# Altium schematic sheet IQ_Modulator.SchDoc: =ProjectName
size 420 x 297 mm; Author: SBH; CompanyName: WUT; DrawnBy: SBH; Organization: ISE-WUT; Address1: Warsaw Univeristy of Technology; Address2: Nowowiejska 15/19; Revision: -; SheetNumber: -; SheetTotal: -; EDA_Number: ARTIQ; Projet: ADC/DAC MEZZANINE; ModifiedBy: -; CreateDate: XX/XX/XXXX; CheckedDate: -; Title2: IQ_Modulator.SchDoc; DivGrp: ISE; Designer: SBH; ModifiedDate: -; ProjectName: ADC/DAC MEZZANINE
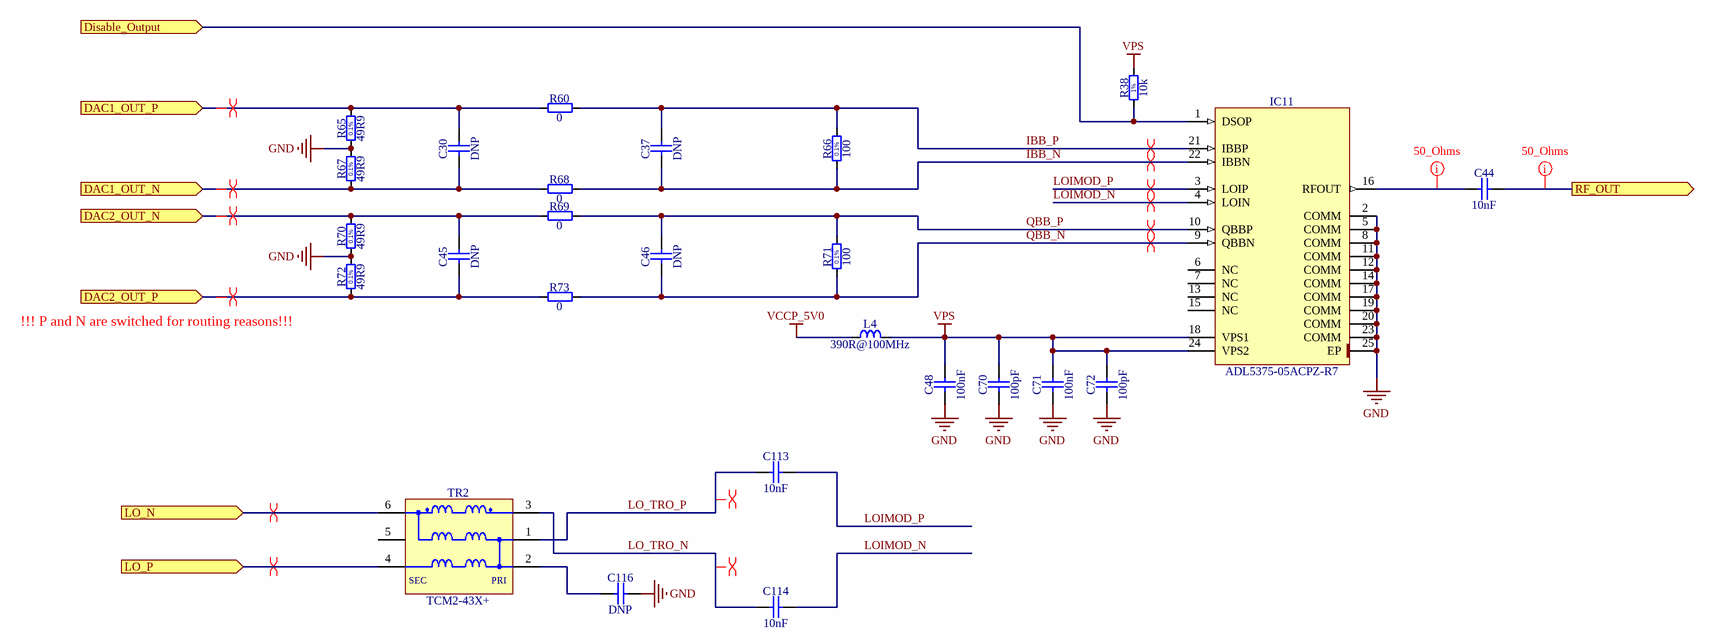
[diagram p0: IQ_Modulator.SchDoc]

## Parts
C30  DNP  [CAPC1005X55N]
C37  DNP  [CAPC1005X55N]
C44  10nF  [CAPC1005X55N]
C45  DNP  [CAPC1005X55N]
C46  DNP  [CAPC1005X55N]
C48  100nF  [CAPC1005X55N]
C70  100pF  [CAPC1005X55N]
C71  100nF  [CAPC1005X55N]
C72  100pF  [CAPC1005X55N]
C113  10nF  [CAPC1005X55N]
C114  10nF  [CAPC1005X55N]
C116  DNP  [CAPC1005X55N]
IC11  ADL5375-05ACPZ-R7  [QFN50P400X400X100-25N-S265]
L4  390R@100MHz  [INDC1608X95N]
R38  10k  [RESC1005X40N]
R60  0  [RESC1005X40N]
R65  49R9  [RESC1005X35N]
R66  100  [RESC1005X35N]
R67  49R9  [RESC1005X35N]
R68  0  [RESC1005X40N]
R69  0  [RESC1005X40N]
R70  49R9  [RESC1005X35N]
R71  100  [RESC1005X35N]
R72  49R9  [RESC1005X35N]
R73  0  [RESC1005X40N]
TR2  TCM2-43X+  [XFMR_MINI-CIRCUITS_DB1627]

## Ports
DAC1_OUT_N (in), DAC1_OUT_P (in), DAC2_OUT_N (in), DAC2_OUT_P (in), Disable_Output (in), LO_N (in), LO_P (in), RF_OUT (out)

## Nets
GND: C48.1 C70.1 C71.1 C72.1 C116.2 IC11.2(COMM) IC11.5(COMM) IC11.8(COMM) IC11.11(COMM) IC11.12(COMM) IC11.14(COMM) IC11.17(COMM) IC11.19(COMM) IC11.20(COMM) IC11.23(COMM) IC11.25(EP) R65.1 R67.2 R70.1 R72.2
VCCP_5V0: L4.1
VPS: C48.2 C70.2 C71.2 C72.2 IC11.18(VPS1) IC11.24(VPS2) L4.2 R38.2
DAC1_OUT_N: C30.1 R67.1 R68.1 ; port DAC1_OUT_N
DAC1_OUT_P: C30.2 R60.1 R65.2 ; port DAC1_OUT_P
DAC2_OUT_N: C45.2 R69.1 R70.2 ; port DAC2_OUT_N
DAC2_OUT_P: C45.1 R72.1 R73.1 ; port DAC2_OUT_P
Disable_Output: IC11.1(DSOP) R38.1 ; port Disable_Output
IBB_N: C37.1 IC11.22(IBBN) R66.1 R68.2
IBB_P: C37.2 IC11.21(IBBP) R60.2 R66.2
LO_N: TR2.6(S1) ; port LO_N
LO_P: TR2.4(S1) ; port LO_P
LO_TRO_N: C114.1 TR2.3(P1)
LO_TRO_P: C113.1 TR2.1(P1)
LOIMOD_N: C114.2 IC11.4(LOIN)
LOIMOD_P: C113.2 IC11.3(LOIP)
QBB_N: C46.1 IC11.9(QBBN) R71.1 R73.2
QBB_P: C46.2 IC11.10(QBBP) R69.2 R71.2
RF_OUT: C44.2 ; port RF_OUT
NetC44_1: C44.1 IC11.16(RFOUT)
NetC116_1: C116.1 TR2.2(P1)

Not connected (* = marked no-connect by the designer): IC11 6(NC) 7(NC) 13(NC) 15(NC); TR2 5(NC)

## Layout directives
net class 50_Ohms: NetC44_1, RF_OUT
differential pair: DAC1_OUT_N, DAC1_OUT_P, DAC2_OUT_N, DAC2_OUT_P, IBB_N, IBB_P, LO_N, LO_P, LO_TRO_N, LO_TRO_P, LOIMOD_N, LOIMOD_P, QBB_N, QBB_P

## Notes on the sheet
- (near R72) !!! P and N are switched for routing reasons!!!
- Project/Equipment
- Document
- Designer
- Drawn by
- Check.by
- File
- Last Mod.
- Print Date
- Sheet
- Size
- A3
- of
- Rev
- (in symbol R0402_10K_1%_0.0625W_100PPM) 1%
- (in symbol R0402_49R9_0.1%_0.063W_25PPM) 0.1%
- (in symbol R0402_100R_0.1%_0.063W_25PPM) 0.1%
- (in symbol XFMR_MINI-CIRCUITS_TCM2-43X+) SEC; PRI

## Library data of the parts
C30 C37 C45 C46 = CC0402_1.5NF_50V_10%_X7R: Non-polarised capacitor; Part Description: SMD Multilayer Chip Ceramic Capacitor; Manufacturer: GENERIC; Manufacturer1 Part Number: 223858715625; Value: 1.5nF; Voltage: 50V; TC: X7R; Tolerance: ±10%; Mounted: DNP; Part Number: CC0402_1.5NF_50V_10%_X7R; Component Kind: Standard; Component Type: Standard; Pin Count: 2; Status: Not Recommended; Manufacturer Part Number: CC0402_1.5NF_50V_10%_X7R; Case: 0402; Socket: No; SMD: Yes; Sense: No; Manufacturer1 Example: PHYCOMP; Manufacturer1 ComponentHeight: 0.55mm; HelpURL: \\cern.ch\dfs\Applications\Altium\Datasheets\CC0402_X7R_PHYCOMP.pdf; Author: CERN DEM JLC; CreateDate: 2007-12-03; LatestRevisionDate: 2007-12-03
C44 C113 C114 = CC0402_10NF_16V_10%_X7R: Non-polarised capacitor; Part Description: SMD Multilayer Chip Ceramic Capacitor; Manufacturer: GENERIC; Manufacturer1 Part Number: 223878715636; Voltage: 16V; TC: X7R; Tolerance: ±10%; Part Number: CC0402_10NF_16V_10%_X7R; Component Kind: Standard; Component Type: Standard; Pin Count: 2; Value: 10nF; Status: Not Recommended; Manufacturer Part Number: CC0402_10NF_16V_10%_X7R; Case: 0402; Mounted: Yes; Socket: No; SMD: Yes; Sense: No; Manufacturer1 Example: PHYCOMP; Manufacturer1 ComponentHeight: 0.55mm; HelpURL: \\cern.ch\dfs\Applications\Altium\Datasheets\CC0402_X7R_PHYCOMP.pdf; Author: CERN DEM JLC; CreateDate: 2007-12-03; LatestRevisionDate: 2007-12-03
C48 C71 = CC0402_100NF_16V_10%_X7R: Non-polarised capacitor; Part Description: SMD Multilayer Chip Ceramic Capacitor; Manufacturer: GENERIC; Manufacturer1 Part Number: GRM155R71C104KA88D; Voltage: 16V; TC: X7R; Tolerance: ±10%; Part Number: CC0402_100NF_16V_10%_X7R; Component Kind: Standard; Component Type: Standard; Pin Count: 2; Value: 100nF; Status: Not Recommended; Manufacturer Part Number: CC0402_100NF_16V_10%_X7R; Case: 0402; Mounted: Yes; Socket: No; SMD: Yes; Sense: No; Manufacturer1 Example: MURATA; Manufacturer1 ComponentHeight: 0.55mm; HelpURL: \\cern.ch\dfs\Applications\Altium\Datasheets\CC0402_X7R_MURATA_GRM.pdf; Author: CERN DEM JLC; CreateDate: 2013-12-05; LatestRevisionDate: 2007-12-03
C70 C72 = CC0402_100PF_50V_5%_C0G: Non-polarised capacitor; Part Description: SMD Multilayer Chip Ceramic Capacitor; Manufacturer: GENERIC; Manufacturer1 Part Number: C0402C101J5GACTU; Voltage: 50V; TC: C0G/NP0; Tolerance: ±5%; Part Number: CC0402_100PF_50V_5%_C0G; Component Kind: Standard; Component Type: Standard; Pin Count: 2; Value: 100pF; Status: Preferred; Manufacturer Part Number: CC0402_100PF_50V_5%_C0G; Case: 0402; Mounted: Yes; Socket: No; SMD: Yes; Sense: No; Manufacturer1 Example: KEMET; Manufacturer1 ComponentHeight: 0.55mm; HelpURL: \\cern.ch\dfs\Applications\Altium\Datasheets\CC0805_C0G_KEMET_(Commercial Grade).pdf; Author: CERN DEM JLC; CreateDate: 2007-12-03; LatestRevisionDate: 2015-04-22
C116 = CC0402_100PF_50V_5%_C0G: Non-polarised capacitor; Part Description: SMD Multilayer Chip Ceramic Capacitor; Manufacturer: GENERIC; Manufacturer1 Part Number: C0402C101J5GACTU; Value: 100pF; Voltage: 50V; TC: C0G/NP0; Tolerance: ±5%; Mounted: DNP; Part Number: CC0402_100PF_50V_5%_C0G; Component Kind: Standard; Component Type: Standard; Pin Count: 2; Status: Preferred; Manufacturer Part Number: CC0402_100PF_50V_5%_C0G; Case: 0402; Socket: No; SMD: Yes; Sense: No; Manufacturer1 Example: KEMET; Manufacturer1 ComponentHeight: 0.55mm; HelpURL: \\cern.ch\dfs\Applications\Altium\Datasheets\CC0805_C0G_KEMET_(Commercial Grade).pdf; Author: CERN DEM JLC; CreateDate: 2007-12-03; LatestRevisionDate: 2015-04-22
IC11 = ADL5375-05ACPZ-R7: 400 MHz to 6 GHz Broadband Quadrature Modulator; Manufacturer: ANALOG DEVICES; PressFit: No; Bonding: No; Part Number: ADL5375-05ACPZ-R7; Component Kind: Standard; Component Type: Standard; Device: ADL5375-05ACPZ-R7; PackageDescription: QFN,0.50mm pitch,square;6 pin X 6 pin,4.0mm X 4.0mm X 1.00mm H body (w/thermal tab 2.65 X 2.65mm),  IPC Medium Density; Part Description: 400 MHz to 6 GHz Broadband Quadrature Modulator; Manufacturer Part Number: ADL5375-05ACPZ-R7; Pin Count: 25; Case: QFN24; Mounted: Yes; Socket: No; SMD: Yes; Sense: No; ComponentHeight: 1mm; Author: CERN DEM JLC; HelpURL: \\cern.ch\dfs\Applications\Altium\Datasheets\ADL5375-05ACPZ-R7.pdf; CreateDate: 2010-08-24; LatestRevisionDate: 2010-08-24
L4 = IND0603_TDK_MPZ1608R391A: Inductor; Part Description: SMT Chip Bead for Power Line; Manufacturer: TDK; Power: 1.2A; Resistance: 0.12R; Tolerance: ±25%; Part Number: IND0603_TDK_MPZ1608R391A; Component Kind: Standard; Component Type: Standard; Pin Count: 2; Value: 390R@100MHz; Status: None; Manufacturer Part Number: MPZ1608R391A; Case: 0603; Mounted: Yes; Socket: No; SMD: Yes; Sense: No; ComponentHeight: 0.95mm; HelpURL: \\cern.ch\dfs\Applications\Altium\Datasheets\IND0603_TDK_MPZ1608.pdf; Author: CERN DEM JLC; CreateDate: 2009-12-02; LatestRevisionDate: 2009-12-02
R38 = R0402_10K_1%_0.0625W_100PPM: Resistor - 1%; Part Description: General Purpose Thick Film Chip Resistor; Manufacturer: GENERIC; Manufacturer1 Part Number: 232270671003L; TC: ±100ppm/°C; Part Number: R0402_10K_1%_0.0625W_100PPM; Component Kind: Standard; Component Type: Standard; Pin Count: 2; Value: 10k; Status: Not recommended; Power: 0.0625W; Tolerance: ±1%; Manufacturer Part Number: R0402_10K_1%_0.0625W_100PPM; Case: 0402; Mounted: Yes; Sense: No; Socket: No; SMD: Yes; Manufacturer1 Example: YAGEO PHYCOMP; Manufacturer1 ComponentHeight: 0.4mm; HelpURL: \\cern.ch\dfs\Applications\Altium\Datasheets\R0402_Phycomp_RC0402.pdf; Author: CERN DEM JLC; CreateDate: 2007-12-03; LatestRevisionDate: 2012-10-17
R60 R68 R69 R73 = R0402_0R_JUMPER: Resistor; Part Description: 1A (0.05R Max DC Resistance) Zero Ohm Jumper; Manufacturer: GENERIC; Manufacturer1 Part Number: 232270591001L; Part Number: R0402_0R_JUMPER; Component Kind: Standard; Component Type: Standard; Pin Count: 2; Value: 0; Status: Not recommended; Manufacturer Part Number: R0402_0R_JUMPER; Case: 0402; Mounted: Yes; Sense: No; Socket: No; SMD: Yes; Manufacturer1 Example: YAGEO PHYCOMP; Manufacturer1 ComponentHeight: 0.4mm; HelpURL: \\cern.ch\dfs\Applications\Altium\Datasheets\R0402_Phycomp_RC0402.pdf; Author: CERN DEM JLC; CreateDate: 2007-12-03; LatestRevisionDate: 2012-10-17
R65 R67 R70 R72 = R0402_49R9_0.1%_0.063W_25PPM: Resistor - 0.1%; Part Description: Thin Film Precision Resistor; Manufacturer: GENERIC; Manufacturer1 Part Number: CPF0402B49R9E1; Power: 0.063W; TC: ±25ppm/°C; Part Number: R0402_49R9_0.1%_0.063W_25PPM; Component Kind: Standard; Component Type: Standard; Pin Count: 2; Value: 49R9; Status: Not Recommended; Tolerance: ±0.1%; Manufacturer Part Number: R0402_49R9_0.1%_0.063W_25PPM; Case: 0402; Mounted: Yes; Sense: No; Socket: No; SMD: Yes; Manufacturer1 Example: TE CONNECTIVITY; Manufacturer1 ComponentHeight: 0.35mm; HelpURL: \\cern.ch\dfs\Applications\Altium\Datasheets\R0402_TYCO_CPF.pdf; Author: CERN DEM JMW; CreateDate: 2015-09-22; LatestRevisionDate: 2015-09-22
R66 R71 = R0402_100R_0.1%_0.063W_25PPM: Resistor - 0.1%; Part Description: Thin Film Precision Resistor; Manufacturer: GENERIC; Manufacturer1 Part Number: CPF0402B100RE1; Power: 0.063W; TC: ±25ppm/°C; Part Number: R0402_100R_0.1%_0.063W_25PPM; Component Kind: Standard; Component Type: Standard; Pin Count: 2; Value: 100; Status: Not Recommended; Tolerance: ±0.1%; Manufacturer Part Number: R0402_100R_0.1%_0.063W_25PPM; Case: 0402; Mounted: Yes; Sense: No; Socket: No; SMD: Yes; Manufacturer1 Example: TE CONNECTIVITY; Manufacturer1 ComponentHeight: 0.35mm; HelpURL: \\cern.ch\dfs\Applications\Altium\Datasheets\R0402_TYCO_CPF.pdf; Author: CERN DEM JMW; CreateDate: 2015-09-22; LatestRevisionDate: 2015-09-22
TR2 = XFMR_MINI-CIRCUITS_TCM2-43X+: 50 OHMS 10 to 4000 MHz RF Transformer; Power: 0.4W; Part Number: XFMR_MINI-CIRCUITS_TCM2-43X+; Component Kind: Standard; Component Type: Standard; Pin Count: 6; Value: TCM2-43X+; Status: None; Part Description: 50 Ohms 10 to 4000MHz RF Transformer; Manufacturer: MINI-CIRCUITS; Manufacturer Part Number: TCM2-43X+; Mounted: Yes; Socket: No; Sense: No; SMD: Yes; ComponentHeight: 4.06mm; HelpURL: \\cern.ch\dfs\Applications\Altium\Datasheets\XFMR_MINI-CIRCUITS_TCM2-43X+.pdf; Author: CERN DEM BC; CreateDate: 2016-02-12; LatestRevisionDate: 2016-02-12